# Altium schematic sheet Controller R2.SchDoc
size A3
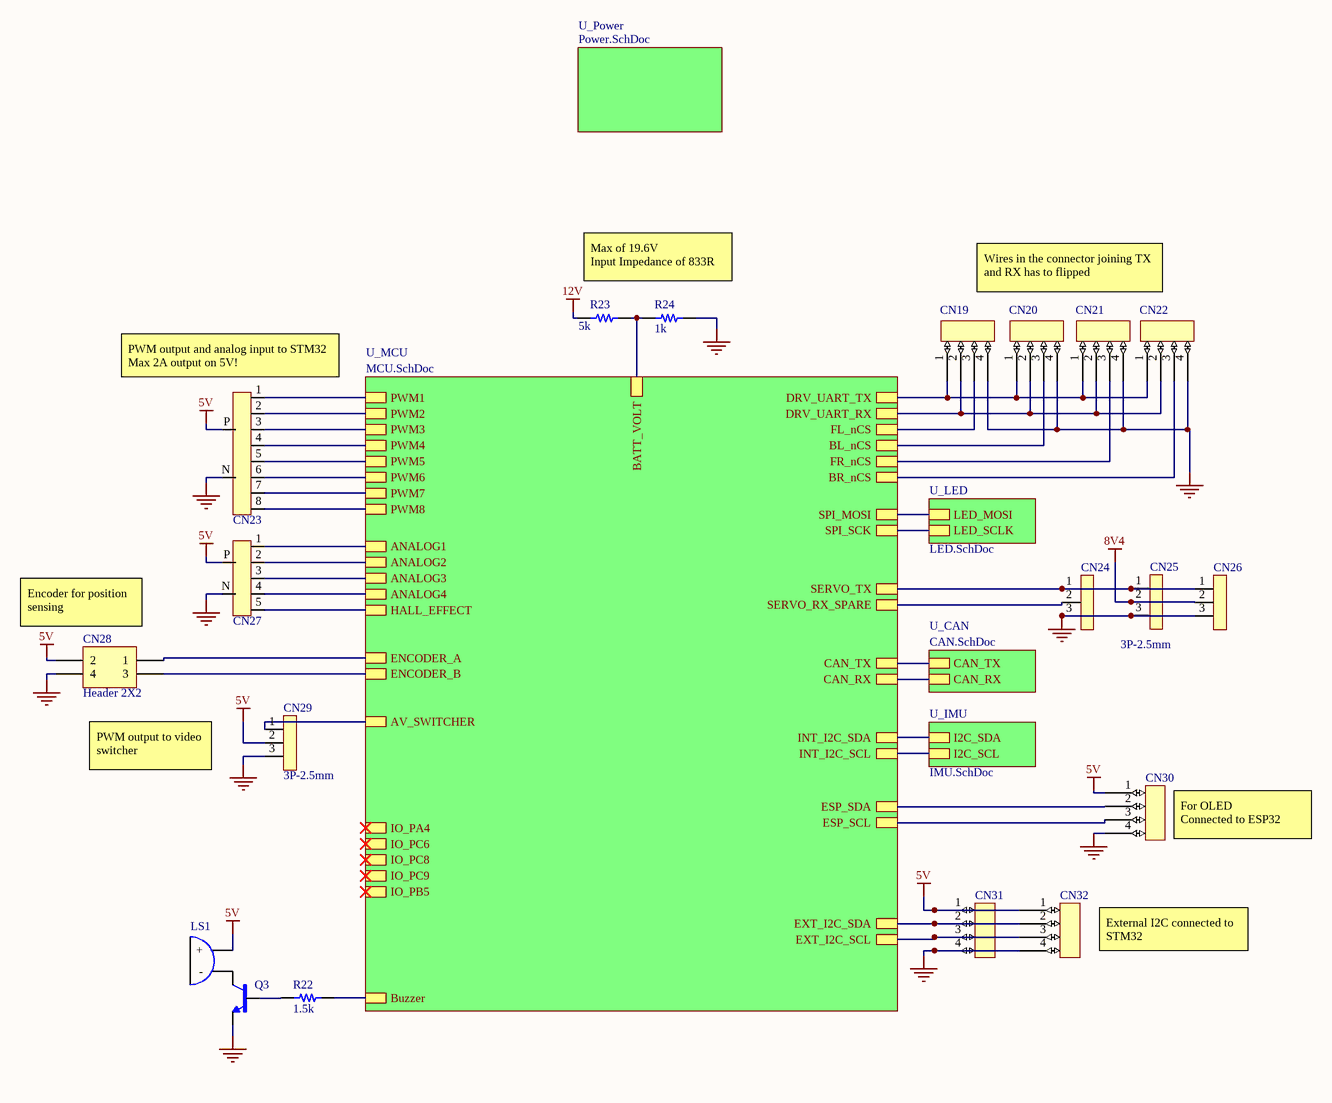
[diagram p0: Controller R2.SchDoc]

## Parts
CN19  JST_GH-4P  [JST_GH-4P]  (value not drawn)
CN20  JST_GH-4P  [JST_GH-4P]  (value not drawn)
CN21  JST_GH-4P  [JST_GH-4P]  (value not drawn)
CN22  JST_GH-4P  [JST_GH-4P]  (value not drawn)
CN23  8P-Signal-2.5mm  [8ch-signal-header]  (value not drawn)
CN24  3P-2.5mm  [2.5mm-3P]  (value not drawn)
CN25  3P-2.5mm  [2.5mm-3P]  (value not drawn)
CN26  3P-2.5mm  [2.5mm-3P]
CN27  5P-Signal-2.5mm  [5ch-signal-header]  (value not drawn)
CN28  Header 2X2  [HDR2X2]
CN29  3P-2.5mm  [2.5mm-3P]
CN30  JST_GH-4P  [JST_GH-4P]  (value not drawn)
CN31  JST_GH-4P  [JST_GH-4P]  (value not drawn)
CN32  JST_GH-4P  [JST_GH-4P]  (value not drawn)
LS1  Buzzer  [12-dia-buzzer]  (value not drawn)
Q3  S8050  [SOT23-FET]  (value not drawn)
R22  1.5k  [0805 - duplicate]
R23  5k  [0805 - duplicate]
R24  1k  [0805 - duplicate]

## Sub-sheets
U_CAN = CAN.SchDoc: CAN_TX, CAN_RX
U_IMU = IMU.SchDoc: I2C_SCL, I2C_SDA
U_LED = LED.SchDoc: LED_MOSI, LED_SCLK
U_MCU = MCU.SchDoc: FL_nCS, BL_nCS, FR_nCS, BR_nCS, PWM5, PWM6, PWM7, PWM8, PWM4, PWM1, ENCODER_A, ENCODER_B, SERVO_TX, SERVO_RX_SPARE, ANALOG1, HALL_EFFECT, ANALOG4, ANALOG3, BATT_VOLT, PWM2, PWM3, SPI_MOSI, SPI_SCK, EXT_I2C_SCL, EXT_I2C_SDA, CAN_TX, CAN_RX, INT_I2C_SDA, INT_I2C_SCL, DRV_UART_RX, DRV_UART_TX, AV_SWITCHER, Buzzer, ESP_SDA, ESP_SCL, IO_PA4, IO_PC6, IO_PC8, IO_PC9, IO_PB5, ANALOG2
U_Power = Power.SchDoc: no entries

## Nets
5V: CN23.P CN27.P CN28.2 CN29.2 CN30.1 CN31.1 CN32.1 LS1.A(+)
8V4: CN25.2 CN26.2
12V: R23.1
GND: CN19.4 CN20.4 CN21.4 CN22.4 CN23.N CN24.3 CN25.3 CN26.3 CN27.N CN28.4 CN29.3 CN30.4 CN31.4 CN32.4 Q3.2(E) R24.2
NetCN19_1: CN19.1 CN20.1 CN21.1 CN22.1 ; sheet U_MCU/DRV_UART_TX
NetCN19_2: CN19.2 CN20.2 CN21.2 CN22.2 ; sheet U_MCU/DRV_UART_RX
NetCN19_3: CN19.3 ; sheet U_MCU/FL_nCS
NetCN20_3: CN20.3 ; sheet U_MCU/BL_nCS
NetCN21_3: CN21.3 ; sheet U_MCU/FR_nCS
NetCN22_3: CN22.3 ; sheet U_MCU/BR_nCS
NetCN23_1: CN23.1 ; sheet U_MCU/PWM1
NetCN23_2: CN23.2 ; sheet U_MCU/PWM2
NetCN23_3: CN23.3 ; sheet U_MCU/PWM3
NetCN23_4: CN23.4 ; sheet U_MCU/PWM4
NetCN23_5: CN23.5 ; sheet U_MCU/PWM5
NetCN23_6: CN23.6 ; sheet U_MCU/PWM6
NetCN23_7: CN23.7 ; sheet U_MCU/PWM7
NetCN23_8: CN23.8 ; sheet U_MCU/PWM8
NetCN24_1: CN24.1 CN25.1 CN26.1 ; sheet U_MCU/SERVO_TX
NetCN24_2: CN24.2 ; sheet U_MCU/SERVO_RX_SPARE
NetCN27_1: CN27.1 ; sheet U_MCU/ANALOG1
NetCN27_2: CN27.2 ; sheet U_MCU/ANALOG2
NetCN27_3: CN27.3 ; sheet U_MCU/ANALOG3
NetCN27_4: CN27.4 ; sheet U_MCU/ANALOG4
NetCN27_5: CN27.5 ; sheet U_MCU/HALL_EFFECT
NetCN28_1: CN28.1 ; sheet U_MCU/ENCODER_A
NetCN28_3: CN28.3 ; sheet U_MCU/ENCODER_B
NetCN29_1: CN29.1 ; sheet U_MCU/AV_SWITCHER
NetCN30_2: CN30.2 ; sheet U_MCU/ESP_SDA
NetCN30_3: CN30.3 ; sheet U_MCU/ESP_SCL
NetCN31_2: CN31.2 CN32.2 ; sheet U_MCU/EXT_I2C_SDA
NetCN31_3: CN31.3 CN32.3 ; sheet U_MCU/EXT_I2C_SCL
NetLS1_K: LS1.K(-) Q3.3(C)
NetQ3_1: Q3.1(B) R22.1
NetR22_2: R22.2 ; sheet U_MCU/Buzzer
NetR23_2: R23.2 R24.1 ; sheet U_MCU/BATT_VOLT
(unnamed): sheet U_CAN/CAN_TX, sheet U_MCU/CAN_TX
(unnamed): sheet U_CAN/CAN_RX, sheet U_MCU/CAN_RX
(unnamed): sheet U_IMU/I2C_SCL, sheet U_MCU/INT_I2C_SCL
(unnamed): sheet U_IMU/I2C_SDA, sheet U_MCU/INT_I2C_SDA
(unnamed): sheet U_LED/LED_MOSI, sheet U_MCU/SPI_MOSI
(unnamed): sheet U_LED/LED_SCLK, sheet U_MCU/SPI_SCK

## Notes on the sheet
- Max of 19.6V
  Input Impedance of 833R
- Wires in the connector joining TX and RX has to flipped
- (near CN23) PWM output and analog input to STM32
  Max 2A output on 5V!
- (near CN28) Encoder for position sensing
- PWM output to video switcher
- (near CN30) For OLED
  Connected to ESP32
- (near CN32) External I2C connected to STM32

## Library data of the parts
CN28 = Header 2X2: Header, 2-Pin, Dual row; LatestRevisionDate: 17-Jul-2002; LatestRevisionNote: Re-released for DXP Platform.; Publisher: Altium Limited
Q3 = S8050: MF: MICROSS/On Semiconductor; MP: 2N2222; Value: *; Package: TO-18-3 NJS; Digi-Key_Purchase_URL: https://www.digikey.com.mx/product-detail/en/microsemi-corporation/JANS2N2222A/1086-15156-ND/4384334?utm_source=snapeda&utm_medium=aggregator&utm_campaign=symbol; SnapEDA_Link: https://www.snapeda.com/parts/2N2222/MICROSS/On%20Semiconductor/view-part/561967/?ref=snap; Digi-Key_Part_Number: 1086-15156-ND
R22-R24 = Resistor